# Altium schematic sheet [8] Red_Driver.SchDoc
size A4
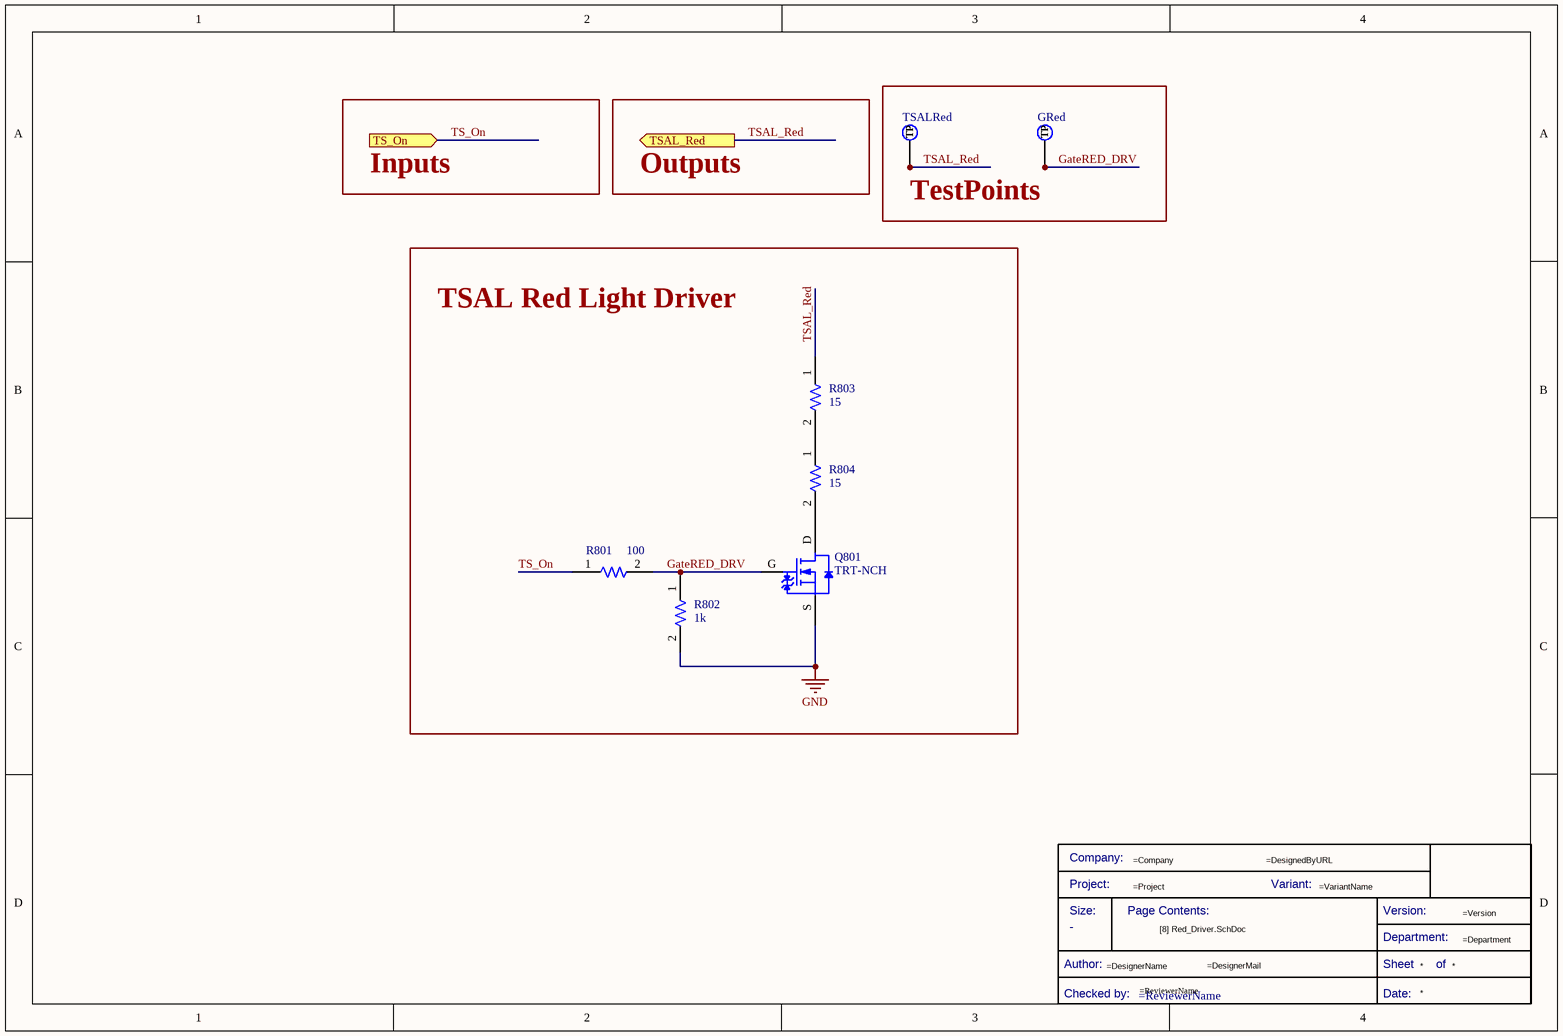
[diagram p0: [8] Red_Driver.SchDoc]

## Parts
*  Title Block_template  (value not drawn)  (graphical)
GRed  TestPoint  [TestPoint]  (value not drawn)  (no BOM)
Q801  TRT-NCH  [TRT-NCH-D2PAK]
R801  value 100  [R0805FTK]  (hidden comment: R100-0805FTK)
R802  value 1k  [R0805FTK]  (hidden comment: R1k-0805FTK)
R803  value 15  [R_3521]  (hidden comment: R15_3521_2W)
R804  value 15  [R_3521]  (hidden comment: R15_3521_2W)
TSALRed  TestPoint  [TestPoint]  (value not drawn)  (no BOM)

## Blocks framed on the sheet
TestPoints: GRed TSALRed
TSAL Red Light Driver: Q801 R801-R804

## Ports
TS_On (in, see [7] TSAL_Red[3A], [7] TSAL_Red[2A]), TSAL_Red (out, see [7] TSAL_Red[3A], [1] TSAL_Green[3A], [2] Implausibilities[1A], [5] SCS[1B], [7] TSAL_Red[2A])

## Nets
GND: Q801.S R802.2
GateRED_DRV: GRed.1(TP) Q801.G R801.2 R802.1
TS_On: R801.1 ; port TS_On
TSAL_Red: R803.1 TSALRed.1(TP) ; port TSAL_Red
NetQ801_D: Q801.D R804.2
NetR803_2: R803.2 R804.1

## Notes on the sheet
- Inputs
- Outputs
- (in symbol CMP-00043-8) Company:; Project:; Variant:; Size:; Page Contents:; Version:; Department:; Author:; Sheet; of; Checked by:; Date:

## Library data of the parts
* = CMP-00043-8: Standard Title Block; .SCHcheck: GP; Checked by:: =ReviewerName; Size: -; Design Item ID: Title Block_template; .PCBcheck: GP; .Creator: GP; Source: e-Tech_Racing.SchLib; Category: Title Block
GRed TSALRed = CMP-00042-2: Test Point 1x1 mm; .SCHcheck: GP; Category: TestPoint; Source: e-Tech_Racing.SchLib; .Creator: GP; .PCBcheck: GP; Design Item ID: TestPoint
Q801 = CMP-00139-1: MOSFET N-CH 100V 31A DPAK; Manufacturer 1: Infineon; Manufacturer Part Number 1: IRFR3410TRPBF; Rds On Max: 39mR; Turn-On Delay Time: 12ns; Polarization: N; Threshold Voltage: 4V; Power Dissipation: 110W; Input Capacitance: 1.69nF; Max Power Dissipation: 3W; Gate to Source Voltage (Vgs): 20V; Turn-Off Delay Time: 40ns; RoHS Compliant: Yes; Number of Pins: 3; Design Item ID: TRT-NCH-31/100; Packaging: Cut Tape; Min Operating Temperature: -55°C; Length: 0.264inch; Max Dual Supply Voltage: 100V; Halogen Free: Halogen Free; Drain to Source Resistance: 39mR; Case/Package: TO-252-3; Mount: Surface Mount; Series: HEXFET®; Source: Semiconductor.SchLib; Stock 1: 4070; Height: 0.094inch; Width: 0.245inch; RoHS: Yes; ComponentLink1URL: https://www.mouser.es/datasheet/2/427/sq2318bes-1868475.pdf; Pricing 1: 1=1,20000, 10=1,08000, 100=0,84200, 500=0,69600 (EUR); ComponentLink1Description: Datasheet; Lead Free: Contains Lead; Drain to Source Breakdown Voltage: 100V; Max Operating Temperature: 175°C; Drain to Source Voltage (Vdss): 100V; Category: MOSFETs; Continuous Drain Current (ID): 31A; Reach SVHC Compliant: Yes
R801 = CMP-00083-3: Res Thick Film 0805 100 Ohm 1% 1/8W ±100ppm/°C Molded SMD SMD Paper Tape on Plastic Reel; Manufacturer Part Number 1: CR0805-FX-1000ELF; Manufacturer 1: Bourns; Power Rating: 125mW; Voltage Rating (DC): 150V; .Creator: DR; Military Standard: Not; Radiation Hardening: No; Max Operating Temperature: 155°C; Packaging: Tape and Reel; ComponentLink3Description: https://datasheet.ciiva.com/6547/chpreztr-6547414.pdf?src-supplier=Digi-Key; RoHS Compliant: Yes; ComponentLink5Description: https://datasheet.ciiva.com/9120/chpreztr-9120744.pdf?src-supplier=Avnet; ComponentLink4URL: https://datasheet.ciiva.com/6547/chpreztr-6547415.pdf?src-supplier=Digi-Key; REACH SVHC: No SVHC; Depth: 1.25mm; Case/Package: 0805; Series: CR0805; Pricing 1: 1=0,05840, 10=0,03430, 25=0,01780, 100=0,00750, 250=0,00560, 500=0,00490, 3000=0,00470 (USD); Features: Moisture Resistant; Design Item ID: R100-0805FTK; Resistor Type: Thick Film; ComponentLink3URL: https://datasheet.ciiva.com/6547/chpreztr-6547414.pdf?src-supplier=Digi-Key; Construction: Rectangular; Width: 1.25mm; ComponentLink4Description: https://datasheet.ciiva.com/6547/chpreztr-6547415.pdf?src-supplier=Digi-Key; Stock 1: 49802; ComponentLink1URL: https://datasheet.ciiva.com/11809/0900766b80fcdb72-11809178.pdf?src-supplier=RSComponents; Number of Terminations: 2; ComponentLink1Description: https://datasheet.ciiva.com/11809/0900766b80fcdb72-11809178.pdf?src-supplier=RSComponents; Length: 2mm; Min Operating Temperature: -55°C; Height: 0.5mm; Mount: Surface Mount; Max Power Dissipation: 125mW; Technology: THICK FILM; Case Code (Metric): 2012; Tolerance: 1%; Category: Chip SMD Resistors; Thickness: 508um; Source: Passives.SchLib; Resistance Tolerance: 1%; RoHS: Yes; ComponentLink5URL: https://datasheet.ciiva.com/9120/chpreztr-9120744.pdf?src-supplier=Avnet; Temperature Coefficient: 100ppm/°C; Package Quantity: 1; Pins: 2; Contact Plating: Tin; Voltage Rating: 150V; Termination: SMD/SMT; ComponentLink2Description: https://datasheet.ciiva.com/6547/chpreztr-6547413.pdf?src-supplier=Digi-Key; ComponentLink2URL: https://datasheet.ciiva.com/6547/chpreztr-6547413.pdf?src-supplier=Digi-Key
R802 = CMP-00076-3: Res Thick Film 0805 1K Ohm 5% 1/8W ±200ppm/°C Molded SMD SMD Paper Tape on Plastic Reel; Manufacturer Part Number 1: CR0805-JW-102ELF; Manufacturer 1: Bourns; Voltage Rating (DC): 150V; Power Rating: 125mW; .Creator: GP; Number of Terminations: 2; REACH SVHC: No SVHC; ComponentLink3URL: https://datasheet.ciiva.com/22693/1902866-22693253.pdf?src-supplier=Element14; ComponentLink1URL: https://datasheet.ciiva.com/11821/0900766b80fcdb72-11821134.pdf?src-supplier=RSComponents; ComponentLink1Description: https://datasheet.ciiva.com/11821/0900766b80fcdb72-11821134.pdf?src-supplier=RSComponents; Category: Chip SMD Resistors; Stock 1: 27510; Case/Package: 0805; ComponentLink3Description: https://datasheet.ciiva.com/22693/1902866-22693253.pdf?src-supplier=Element14; Length: 2mm; ComponentLink5URL: https://datasheet.ciiva.com/7985/1856384-7985867.pdf?src-supplier=Element14; ComponentLink7Description: https://datasheet.ciiva.com/6547/chpreztr-6547359.pdf?src-supplier=Digi-Key; Package Quantity: 1; Tolerance: 5%; Lead Free: Lead Free; RoHS: Yes; Contact Plating: Tin; ComponentLink2Description: https://datasheet.ciiva.com/15225/getdatasheetpartid-78155-15225381.pdf?src-supplier=Verical; ComponentLink5Description: https://datasheet.ciiva.com/7985/1856384-7985867.pdf?src-supplier=Element14; Depth: 1.25mm; Thickness: 508um; Resistor Type: Thick Film; Design Item ID: R1k-0805FTK; ComponentLink2URL: https://datasheet.ciiva.com/15225/getdatasheetpartid-78155-15225381.pdf?src-supplier=Verical; Max Operating Temperature: 155°C; ComponentLink6URL: https://datasheet.ciiva.com/30242/159chpreztr-30242765.pdf?src-supplier=Onlinecomponents.com; ComponentLink4URL: https://datasheet.ciiva.com/7986/1856384-7986184.pdf?src-supplier=Element14; Military Standard: Not; Case Code (Metric): 2012; Temperature Coefficient: 200ppm/°C; Pricing 1: 1=0,05930, 10=0,03510, 25=0,01790, 100=0,00800, 250=0,00790, 500=0,00590, 1000=0,00360, 3000=0,00350, 6000=0,00250 (USD); Min Operating Temperature: -55°C; ComponentLink7URL: https://datasheet.ciiva.com/6547/chpreztr-6547359.pdf?src-supplier=Digi-Key; Width: 1.25mm; Source: Passives.SchLib; Max Power Dissipation: 125mW; Voltage Rating: 150V; ComponentLink4Description: https://datasheet.ciiva.com/7986/1856384-7986184.pdf?src-supplier=Element14; Features: Moisture Resistant; Mount: Surface Mount; Termination: SMD/SMT; Height: 0.5mm; Radiation Hardening: No; ComponentLink6Description: https://datasheet.ciiva.com/30242/159chpreztr-30242765.pdf?src-supplier=Onlinecomponents.com; Pins: 2; Packaging: Tape and Reel
R803 R804 = CMP-00075-7: Res Thick Film 2512 15 Ohm 1% 2W ±100ppm/C Pad SMD T/R; Manufacturer Part Number 1: 352115RFT; Manufacturer 1: TE Connectivity; .Creator: DR; Voltage Rating: 250V; Temperature Coefficient: 100ppm/°C; Number of Resistors: 1; Features: Automotive AEC-Q200; RoHS: Yes; ComponentLink2Description: Where buy it; Pricing 1: 10=0,64300, 250=0,62200, 1000=0,60000, 2000=0,55400, 2500=0,52100 (USD); ComponentLink1Description: Datasheet; Technology: THICK FILM; Stock 1: 1; Termination: Solder; ComponentLink2URL: https://es.rs-online.com/web/p/resistencias-de-montaje-en-superficie/7551110; Mount: Surface Mount; Resistance Tolerance: 1%; ComponentLink4Description: https://datasheet.ciiva.com/46391/1610601-46391493.pdf?src-supplier=Element14; Category: Chip SMD Resistors; Series: 3521, CGS; Depth: 3.2mm; ELV: Compliant; Tolerance: 1%; ComponentLink5Description: https://datasheet.ciiva.com/7657/1610601-7657542.pdf?src-supplier=Element14; Case Code (Metric): 6432; Design Item ID: R15-2512FTK; ComponentLink1URL: https://docs.rs-online.com/8bc1/0900766b81096b90.pdf; Max Operating Temperature: 155°C; ComponentLink4URL: https://datasheet.ciiva.com/46391/1610601-46391493.pdf?src-supplier=Element14; RoHS Compliant: Yes; Number of Terminations: 2; Source: Passives.SchLib; Resistor Type: Thick Film,Power resistor; Height: 0.55mm; Case/Package: 2512; ComponentLink3URL: https://datasheet.ciiva.com/25610/0900766b81096b90-25610033.pdf?src-supplier=RSComponents; Max Power Dissipation: 2W; Length: 6.3mm; Packaging: Tape and Reel; ComponentLink3Description: https://datasheet.ciiva.com/25610/0900766b81096b90-25610033.pdf?src-supplier=RSComponents; Voltage Rating (DC): 250V; Min Operating Temperature: -55°C; REACH SVHC: No SVHC; ComponentLink5URL: https://datasheet.ciiva.com/7657/1610601-7657542.pdf?src-supplier=Element14